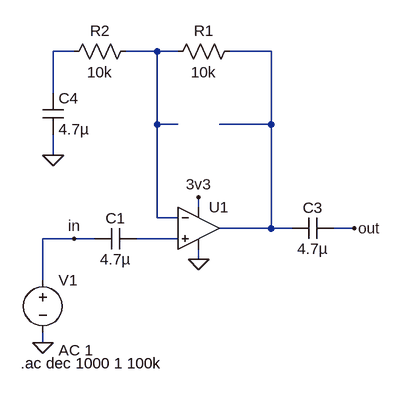
[diagram p0: schematic lm358_amplifier_bode.asc]
lm358_amplifier_bode.asc, the LTspice schematic file:
Version 4
SHEET 1 880 680
WIRE -16 -128 -48 -128
WIRE 112 -128 64 -128
WIRE 144 -128 112 -128
WIRE 288 -128 224 -128
WIRE -48 -64 -48 -128
WIRE 112 -16 112 -128
WIRE 144 -16 112 -16
WIRE 288 -16 288 -128
WIRE 288 -16 208 -16
WIRE -48 32 -48 0
WIRE 176 112 176 96
WIRE 112 128 112 -16
WIRE 144 128 112 128
WIRE 288 144 288 -16
WIRE 288 144 208 144
WIRE 320 144 288 144
WIRE 416 144 384 144
WIRE -16 160 -64 160
WIRE 16 160 -16 160
WIRE 144 160 80 160
WIRE 176 192 176 176
WIRE -64 224 -64 160
WIRE -64 320 -64 304
FLAG 176 96 3v3
FLAG 176 192 0
FLAG -64 320 0
FLAG -16 160 in
FLAG 416 144 out
FLAG -48 32 0
SYMBOL OpAmps\\UniversalOpAmp2 176 144 R0
SYMATTR InstName U1
SYMBOL cap 80 144 R90
WINDOW 0 0 32 VBottom 2
WINDOW 3 32 32 VTop 2
SYMATTR InstName C1
SYMATTR Value 4.7µ
SYMBOL res 240 -144 R90
WINDOW 0 0 56 VBottom 2
WINDOW 3 32 56 VTop 2
SYMATTR InstName R1
SYMATTR Value 10k
SYMBOL voltage -64 208 R0
WINDOW 123 24 124 Left 2
WINDOW 39 0 0 Left 0
SYMATTR InstName V1
SYMATTR Value ""
SYMATTR Value2 AC 1
SYMBOL cap 384 128 R90
WINDOW 0 0 32 VBottom 2
WINDOW 3 32 32 VTop 2
SYMATTR InstName C3
SYMATTR Value 4.7µ
SYMBOL res 80 -144 R90
WINDOW 0 0 56 VBottom 2
WINDOW 3 32 56 VTop 2
SYMATTR InstName R2
SYMATTR Value 10k
SYMBOL cap -64 -64 R0
SYMATTR InstName C4
SYMATTR Value 4.7µ
TEXT -98 352 Left 2 !.ac dec 1000 1 100k

The netlist it stands for:
* lm358_amplifier_bode.asc
XU1 N004 N002 3v3 0 N003 level2 Avol=1Meg GBW=10Meg Slew=10Meg Ilimit=25m Rail=0 Vos=0 En=0 Enk=0 In=0 Ink=0 Rin=500Meg  ; pins In+ In- V+ V- OUT
C1 N004 in 4.7µ
R1 N003 N002 10k
V1 in 0 AC 1
C3 out N003 4.7µ
R2 N002 N001 10k
C4 N001 0 4.7µ
.ac dec 1000 1 100k
.lib UniversalOpAmp2.lib
.backanno
.end

* Results of the author's LTspice run, read from the files saved beside the schematic
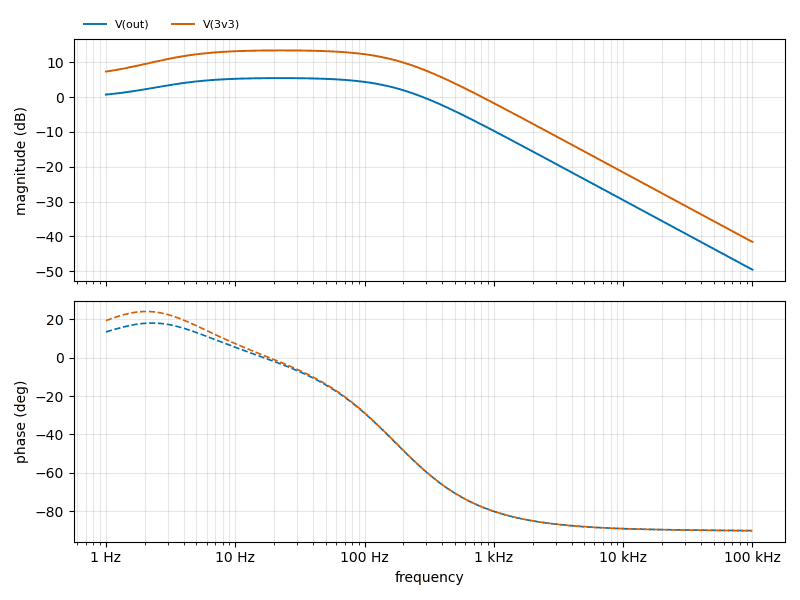
[diagram p1: AC Analysis of lm358_amplifier_bode.asc, plotted from the saved traces]
* AC Analysis, 1 run:
*   V(out): 0.75 dB at 1 Hz, -49.54 dB at 100 kHz, peak 5.48 dB at 22.18 Hz, 3 dB below the peak at 2.159 Hz and 180 Hz
*   V(3v3): 7.36 dB at 1 Hz, -41.58 dB at 100 kHz, peak 13.43 dB at 22.86 Hz, 3 dB below the peak at 2.575 Hz and 180.4 Hz